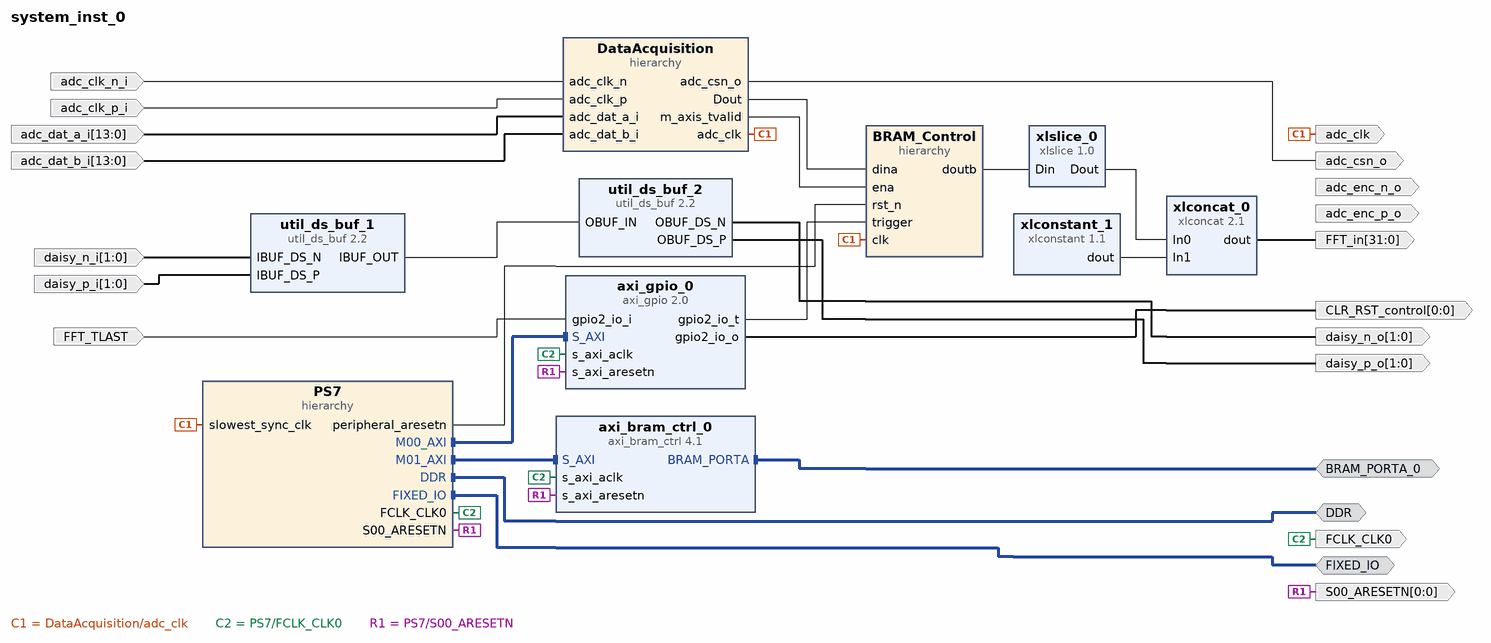
[diagram p0: block diagram of the top level]
# Vivado block design system_inst_0, xc7z010clg400-1, Vivado 2024.2
create_bd_design system_inst_0

create_bd_intf_port -mode Master -vlnv xilinx.com:interface:ddrx_rtl:1.0 DDR
create_bd_intf_port -mode Master -vlnv xilinx.com:display_processing_system7:fixedio_rtl:1.0 FIXED_IO
create_bd_intf_port -mode Master -vlnv xilinx.com:interface:bram_rtl:1.0 BRAM_PORTA_0
create_bd_port -dir I -from 13 -to 0 adc_dat_a_i
create_bd_port -dir I -from 13 -to 0 adc_dat_b_i
create_bd_port -dir O adc_enc_p_o
create_bd_port -dir O adc_enc_n_o
create_bd_port -dir O adc_csn_o
create_bd_port -dir O -from 1 -to 0 daisy_p_o
create_bd_port -dir O -from 1 -to 0 daisy_n_o
create_bd_port -dir I -from 1 -to 0 daisy_p_i
create_bd_port -dir I -from 1 -to 0 daisy_n_i
create_bd_port -dir O -from 31 -to 0 FFT_in
create_bd_port -dir O -from 0 -to 0 CLR_RST_control
create_bd_port -dir I FFT_TLAST
create_bd_port -dir O -type clk FCLK_CLK0
create_bd_port -dir O -from 0 -to 0 -type rst S00_ARESETN
create_bd_port -dir I -type clk adc_clk_p_i
create_bd_port -dir I -type clk adc_clk_n_i
create_bd_port -dir O -type clk adc_clk

create_bd_cell -type ip -vlnv xilinx.com:ip:util_ds_buf:2.2 util_ds_buf_1
set_property -dict {CONFIG.C_SIZE 2} [get_bd_cells util_ds_buf_1]
create_bd_cell -type ip -vlnv xilinx.com:ip:util_ds_buf:2.2 util_ds_buf_2
set_property -dict {CONFIG.C_BUF_TYPE OBUFDS CONFIG.C_SIZE 2} [get_bd_cells util_ds_buf_2]
create_bd_cell -type hier PS7
create_bd_cell -type hier DataAcquisition
create_bd_cell -type ip -vlnv xilinx.com:ip:axi_gpio:2.0 axi_gpio_0
set_property -dict [list \
  CONFIG.C_ALL_INPUTS 1 \
  CONFIG.C_ALL_OUTPUTS_2 0 \
  CONFIG.C_GPIO2_WIDTH 1 \
  CONFIG.C_GPIO_WIDTH 32 \
  CONFIG.C_INTERRUPT_PRESENT 0 \
  CONFIG.C_IS_DUAL 1 \
] [get_bd_cells axi_gpio_0]
create_bd_cell -type hier BRAM_Control
create_bd_cell -type ip -vlnv xilinx.com:ip:xlslice:1.0 xlslice_0
set_property -dict {CONFIG.DIN_FROM 15} [get_bd_cells xlslice_0]
create_bd_cell -type ip -vlnv xilinx.com:ip:xlconstant:1.1 xlconstant_1
set_property -dict {CONFIG.CONST_VAL 0 CONFIG.CONST_WIDTH 16} [get_bd_cells xlconstant_1]
create_bd_cell -type ip -vlnv xilinx.com:ip:xlconcat:2.1 xlconcat_0
set_property -dict {CONFIG.IN0_WIDTH 16 CONFIG.IN1_WIDTH 16} [get_bd_cells xlconcat_0]
create_bd_cell -type ip -vlnv xilinx.com:ip:axi_bram_ctrl:4.1 axi_bram_ctrl_0
set_property -dict {CONFIG.DATA_WIDTH 64 CONFIG.SINGLE_PORT_BRAM 1} [get_bd_cells axi_bram_ctrl_0]

# ---- hierarchy /PS7 ----
current_bd_instance /PS7
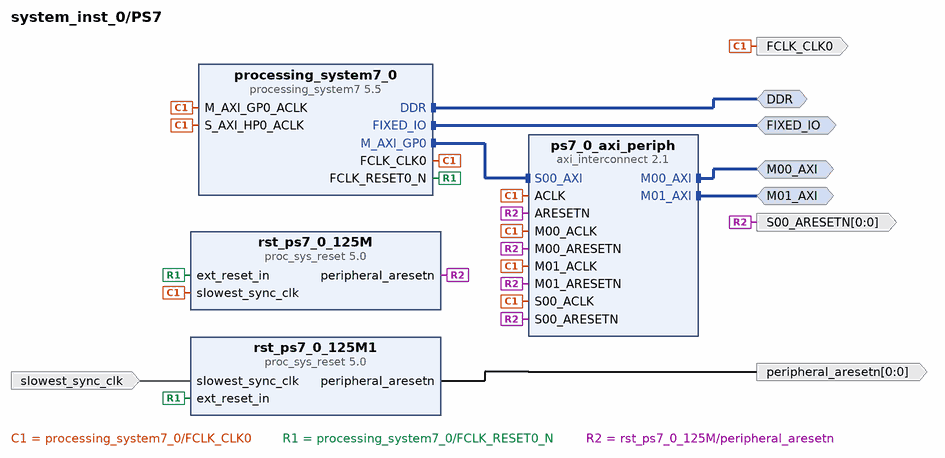
[diagram p1: block diagram inside /PS7]
create_bd_intf_pin -mode Master -vlnv xilinx.com:interface:ddrx_rtl:1.0 DDR
create_bd_intf_pin -mode Master -vlnv xilinx.com:display_processing_system7:fixedio_rtl:1.0 FIXED_IO
create_bd_intf_pin -mode Master -vlnv xilinx.com:interface:aximm_rtl:1.0 M00_AXI
create_bd_intf_pin -mode Master -vlnv xilinx.com:interface:aximm_rtl:1.0 M01_AXI
create_bd_pin -dir O -type clk FCLK_CLK0
create_bd_pin -dir O -from 0 -to 0 -type rst S00_ARESETN
create_bd_pin -dir I -type clk slowest_sync_clk
create_bd_pin -dir O -from 0 -to 0 -type rst peripheral_aresetn

create_bd_cell -type ip -vlnv xilinx.com:ip:processing_system7:5.5 processing_system7_0
set_property -dict [list \
  CONFIG.PCW_APU_PERIPHERAL_FREQMHZ 666.666666 \
  CONFIG.PCW_ENET0_ENET0_IO {MIO 16 .. 27} \
  CONFIG.PCW_ENET0_GRP_MDIO_ENABLE 1 \
  CONFIG.PCW_ENET0_GRP_MDIO_IO EMIO \
  CONFIG.PCW_ENET0_PERIPHERAL_ENABLE 1 \
  CONFIG.PCW_ENET0_RESET_ENABLE 0 \
  CONFIG.PCW_ENET_RESET_ENABLE 1 \
  CONFIG.PCW_ENET_RESET_SELECT {Share reset pin} \
  CONFIG.PCW_FPGA0_PERIPHERAL_FREQMHZ 125 \
  CONFIG.PCW_FPGA1_PERIPHERAL_FREQMHZ 250 \
  CONFIG.PCW_FPGA3_PERIPHERAL_FREQMHZ 200 \
  CONFIG.PCW_GPIO_MIO_GPIO_ENABLE 1 \
  CONFIG.PCW_GPIO_MIO_GPIO_IO MIO \
  CONFIG.PCW_GPIO_PERIPHERAL_ENABLE 1 \
  CONFIG.PCW_I2C0_GRP_INT_ENABLE 0 \
  CONFIG.PCW_I2C0_I2C0_IO {MIO 50 .. 51} \
  CONFIG.PCW_I2C0_PERIPHERAL_ENABLE 1 \
  CONFIG.PCW_I2C_PERIPHERAL_FREQMHZ 111.111115 \
  CONFIG.PCW_I2C_RESET_ENABLE 1 \
  CONFIG.PCW_I2C_RESET_SELECT {Share reset pin} \
  CONFIG.PCW_IMPORT_BOARD_PRESET cfg/red_pitaya.xml \
  CONFIG.PCW_PRESET_BANK1_VOLTAGE {LVCMOS 2.5V} \
  CONFIG.PCW_QSPI_GRP_SINGLE_SS_ENABLE 1 \
  CONFIG.PCW_QSPI_GRP_SINGLE_SS_IO {MIO 1 .. 6} \
  CONFIG.PCW_QSPI_PERIPHERAL_ENABLE 1 \
  CONFIG.PCW_QSPI_PERIPHERAL_FREQMHZ 125 \
  CONFIG.PCW_QSPI_QSPI_IO {MIO 1 .. 6} \
  CONFIG.PCW_SD0_GRP_CD_ENABLE 1 \
  CONFIG.PCW_SD0_GRP_CD_IO {MIO 46} \
  CONFIG.PCW_SD0_GRP_WP_ENABLE 1 \
  CONFIG.PCW_SD0_GRP_WP_IO {MIO 47} \
  CONFIG.PCW_SD0_PERIPHERAL_ENABLE 1 \
  CONFIG.PCW_SD0_SD0_IO {MIO 40 .. 45} \
  CONFIG.PCW_SDIO_PERIPHERAL_FREQMHZ 100 \
  CONFIG.PCW_SINGLE_QSPI_DATA_MODE x4 \
  CONFIG.PCW_SPI0_PERIPHERAL_ENABLE 1 \
  CONFIG.PCW_SPI0_SPI0_IO EMIO \
  CONFIG.PCW_SPI1_PERIPHERAL_ENABLE 1 \
  CONFIG.PCW_SPI1_SPI1_IO {MIO 10 .. 15} \
  CONFIG.PCW_TTC0_PERIPHERAL_ENABLE 1 \
  CONFIG.PCW_TTC0_TTC0_IO EMIO \
  CONFIG.PCW_UART0_PERIPHERAL_ENABLE 1 \
  CONFIG.PCW_UART0_UART0_IO {MIO 14 .. 15} \
  CONFIG.PCW_UART1_PERIPHERAL_ENABLE 1 \
  CONFIG.PCW_UART1_UART1_IO {MIO 8 .. 9} \
  CONFIG.PCW_UART_PERIPHERAL_FREQMHZ 100 \
  CONFIG.PCW_UIPARAM_DDR_BUS_WIDTH {16 Bit} \
  CONFIG.PCW_UIPARAM_DDR_FREQ_MHZ 533.333333 \
  CONFIG.PCW_UIPARAM_DDR_PARTNO {MT41J256M16 RE-125} \
  CONFIG.PCW_USB0_PERIPHERAL_ENABLE 1 \
  CONFIG.PCW_USB0_RESET_ENABLE 1 \
  CONFIG.PCW_USB0_RESET_IO {MIO 48} \
  CONFIG.PCW_USB0_USB0_IO {MIO 28 .. 39} \
  CONFIG.PCW_USB_RESET_ENABLE 1 \
  CONFIG.PCW_USB_RESET_SELECT {Share reset pin} \
  CONFIG.PCW_USE_S_AXI_HP0 1 \
] [get_bd_cells processing_system7_0]
# 425 more settings of processing_system7_0 are not shown: defaults, MIO pin electricals, DDR timing, and values the tool derives
create_bd_cell -type ip -vlnv xilinx.com:ip:proc_sys_reset:5.0 rst_ps7_0_125M
create_bd_cell -type ip -vlnv xilinx.com:ip:axi_interconnect:2.1 ps7_0_axi_periph
set_property -dict {CONFIG.NUM_MI 2} [get_bd_cells ps7_0_axi_periph]
create_bd_cell -type ip -vlnv xilinx.com:ip:proc_sys_reset:5.0 rst_ps7_0_125M1

# ---- hierarchy /DataAcquisition ----
current_bd_instance /DataAcquisition
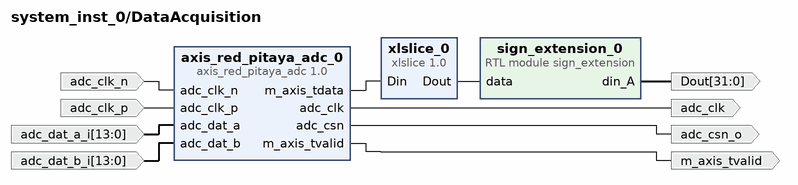
[diagram p2: block diagram inside /DataAcquisition]
create_bd_pin -dir O -type clk adc_clk
create_bd_pin -dir O adc_csn_o
create_bd_pin -dir I -from 13 -to 0 adc_dat_a_i
create_bd_pin -dir I -from 13 -to 0 adc_dat_b_i
create_bd_pin -dir O -from 31 -to 0 Dout
create_bd_pin -dir O m_axis_tvalid
create_bd_pin -dir I -type clk adc_clk_p
create_bd_pin -dir I -type clk adc_clk_n

create_bd_cell -type ip -vlnv pavel-demin:user:axis_red_pitaya_adc:1.0 axis_red_pitaya_adc_0
create_bd_cell -type ip -vlnv xilinx.com:ip:xlslice:1.0 xlslice_0
set_property -dict {CONFIG.DIN_FROM 15} [get_bd_cells xlslice_0]
create_bd_cell -type module -reference sign_extension sign_extension_0

# ---- hierarchy /BRAM_Control ----
current_bd_instance /BRAM_Control
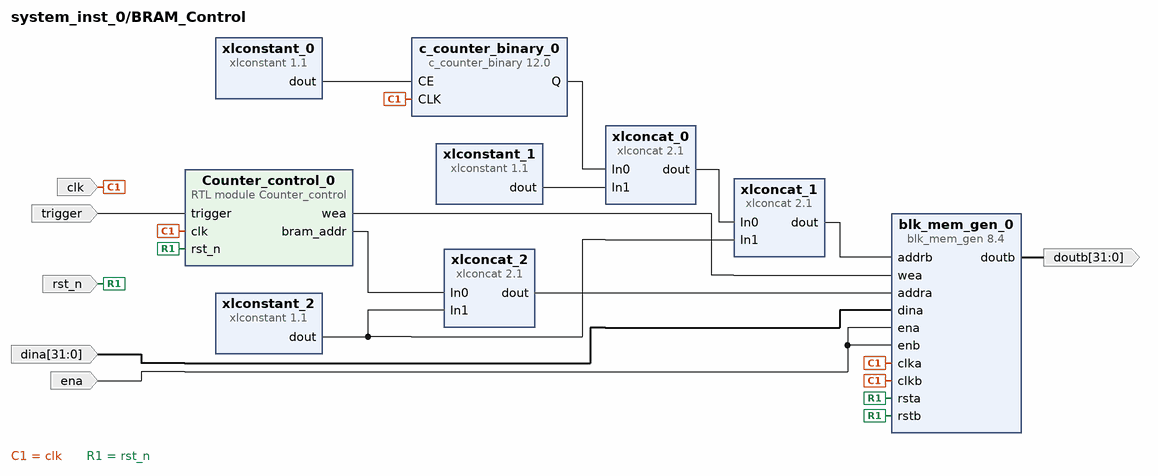
[diagram p3: block diagram inside /BRAM_Control]
create_bd_pin -dir I -type clk clk
create_bd_pin -dir I -type rst rst_n
create_bd_pin -dir I -from 31 -to 0 dina
create_bd_pin -dir I ena
create_bd_pin -dir I trigger
create_bd_pin -dir O -from 31 -to 0 doutb

create_bd_cell -type ip -vlnv xilinx.com:ip:blk_mem_gen:8.4 blk_mem_gen_0
set_property -dict {CONFIG.Memory_Type True_Dual_Port_RAM CONFIG.use_bram_block BRAM_Controller} [get_bd_cells blk_mem_gen_0]
create_bd_cell -type module -reference Counter_control Counter_control_0
create_bd_cell -type ip -vlnv xilinx.com:ip:c_counter_binary:12.0 c_counter_binary_0
set_property -dict [list \
  CONFIG.AINIT_Value 3FF \
  CONFIG.CE true \
  CONFIG.Implementation Fabric \
  CONFIG.Increment_Value 1 \
  CONFIG.Load false \
  CONFIG.Output_Width 10 \
  CONFIG.Restrict_Count false \
  CONFIG.SCLR false \
  CONFIG.SINIT false \
  CONFIG.SSET false \
] [get_bd_cells c_counter_binary_0]
create_bd_cell -type ip -vlnv xilinx.com:ip:xlconstant:1.1 xlconstant_0
create_bd_cell -type ip -vlnv xilinx.com:ip:xlconcat:2.1 xlconcat_0
set_property -dict {CONFIG.IN0_WIDTH 10 CONFIG.IN1_WIDTH 2} [get_bd_cells xlconcat_0]
create_bd_cell -type ip -vlnv xilinx.com:ip:xlconstant:1.1 xlconstant_1
set_property -dict {CONFIG.CONST_VAL 0 CONFIG.CONST_WIDTH 2} [get_bd_cells xlconstant_1]
create_bd_cell -type ip -vlnv xilinx.com:ip:xlconstant:1.1 xlconstant_2
set_property -dict {CONFIG.CONST_VAL 0 CONFIG.CONST_WIDTH 20} [get_bd_cells xlconstant_2]
create_bd_cell -type ip -vlnv xilinx.com:ip:xlconcat:2.1 xlconcat_1
set_property -dict {CONFIG.IN0_WIDTH 12 CONFIG.IN1_WIDTH 20} [get_bd_cells xlconcat_1]
create_bd_cell -type ip -vlnv xilinx.com:ip:xlconcat:2.1 xlconcat_2
set_property -dict {CONFIG.IN0_WIDTH 12 CONFIG.IN1_WIDTH 20} [get_bd_cells xlconcat_2]

# ---- connections ----

current_bd_instance /PS7
connect_bd_intf_net [get_bd_intf_pins DDR] [get_bd_intf_pins processing_system7_0/DDR]
connect_bd_intf_net [get_bd_intf_pins FIXED_IO] [get_bd_intf_pins processing_system7_0/FIXED_IO]
connect_bd_intf_net [get_bd_intf_pins processing_system7_0/M_AXI_GP0] [get_bd_intf_pins ps7_0_axi_periph/S00_AXI]
connect_bd_intf_net [get_bd_intf_pins M00_AXI] [get_bd_intf_pins ps7_0_axi_periph/M00_AXI]
connect_bd_intf_net [get_bd_intf_pins M01_AXI] [get_bd_intf_pins ps7_0_axi_periph/M01_AXI]
connect_bd_net [get_bd_pins processing_system7_0/FCLK_CLK0] \
  [get_bd_pins FCLK_CLK0] [get_bd_pins processing_system7_0/S_AXI_HP0_ACLK] [get_bd_pins ps7_0_axi_periph/S00_ACLK] \
  [get_bd_pins rst_ps7_0_125M/slowest_sync_clk] [get_bd_pins ps7_0_axi_periph/M00_ACLK] [get_bd_pins ps7_0_axi_periph/ACLK] \
  [get_bd_pins ps7_0_axi_periph/M01_ACLK] [get_bd_pins processing_system7_0/M_AXI_GP0_ACLK]
connect_bd_net [get_bd_pins processing_system7_0/FCLK_RESET0_N] [get_bd_pins rst_ps7_0_125M/ext_reset_in] [get_bd_pins rst_ps7_0_125M1/ext_reset_in]
connect_bd_net [get_bd_pins rst_ps7_0_125M1/peripheral_aresetn] [get_bd_pins peripheral_aresetn]
connect_bd_net [get_bd_pins rst_ps7_0_125M/peripheral_aresetn] \
  [get_bd_pins S00_ARESETN] [get_bd_pins ps7_0_axi_periph/S00_ARESETN] [get_bd_pins ps7_0_axi_periph/M00_ARESETN] \
  [get_bd_pins ps7_0_axi_periph/ARESETN] [get_bd_pins ps7_0_axi_periph/M01_ARESETN]
connect_bd_net [get_bd_pins slowest_sync_clk] [get_bd_pins rst_ps7_0_125M1/slowest_sync_clk]
set_property HDL_ATTRIBUTE.BMM_INFO_PROCESSOR {arm > system BRAM_Control/axi_bram_ctrl_0} [get_bd_cells processing_system7_0]
set_property HDL_ATTRIBUTE.KEEP_HIERARCHY yes [get_bd_cells processing_system7_0]

current_bd_instance /DataAcquisition
connect_bd_net -net adc_clk_n_0_1 [get_bd_pins adc_clk_n] [get_bd_pins axis_red_pitaya_adc_0/adc_clk_n]
connect_bd_net -net adc_clk_p_0_1 [get_bd_pins adc_clk_p] [get_bd_pins axis_red_pitaya_adc_0/adc_clk_p]
connect_bd_net [get_bd_pins adc_dat_a_i] [get_bd_pins axis_red_pitaya_adc_0/adc_dat_a]
connect_bd_net [get_bd_pins adc_dat_b_i] [get_bd_pins axis_red_pitaya_adc_0/adc_dat_b]
connect_bd_net [get_bd_pins axis_red_pitaya_adc_0/adc_clk] [get_bd_pins adc_clk]
connect_bd_net [get_bd_pins axis_red_pitaya_adc_0/adc_csn] [get_bd_pins adc_csn_o]
connect_bd_net [get_bd_pins axis_red_pitaya_adc_0/m_axis_tdata] [get_bd_pins xlslice_0/Din]
connect_bd_net [get_bd_pins axis_red_pitaya_adc_0/m_axis_tvalid] [get_bd_pins m_axis_tvalid]
connect_bd_net [get_bd_pins sign_extension_0/din_A] [get_bd_pins Dout]
connect_bd_net [get_bd_pins xlslice_0/Dout] [get_bd_pins sign_extension_0/data]

current_bd_instance /BRAM_Control
connect_bd_net [get_bd_pins Counter_control_0/bram_addr] [get_bd_pins xlconcat_2/In0]
connect_bd_net [get_bd_pins Counter_control_0/wea] [get_bd_pins blk_mem_gen_0/wea]
connect_bd_net -net DataAcquisition_adc_clk [get_bd_pins clk] \
  [get_bd_pins blk_mem_gen_0/clka] [get_bd_pins Counter_control_0/clk] [get_bd_pins blk_mem_gen_0/clkb] \
  [get_bd_pins c_counter_binary_0/CLK]
connect_bd_net [get_bd_pins blk_mem_gen_0/doutb] [get_bd_pins doutb]
connect_bd_net [get_bd_pins c_counter_binary_0/Q] [get_bd_pins xlconcat_0/In0]
connect_bd_net [get_bd_pins dina] [get_bd_pins blk_mem_gen_0/dina]
connect_bd_net [get_bd_pins ena] [get_bd_pins blk_mem_gen_0/ena] [get_bd_pins blk_mem_gen_0/enb]
connect_bd_net [get_bd_pins rst_n] [get_bd_pins Counter_control_0/rst_n] [get_bd_pins blk_mem_gen_0/rsta] [get_bd_pins blk_mem_gen_0/rstb]
connect_bd_net [get_bd_pins trigger] [get_bd_pins Counter_control_0/trigger]
connect_bd_net [get_bd_pins xlconcat_0/dout] [get_bd_pins xlconcat_1/In0]
connect_bd_net [get_bd_pins xlconcat_1/dout] [get_bd_pins blk_mem_gen_0/addrb]
connect_bd_net [get_bd_pins xlconcat_2/dout] [get_bd_pins blk_mem_gen_0/addra]
connect_bd_net [get_bd_pins xlconstant_0/dout] [get_bd_pins c_counter_binary_0/CE]
connect_bd_net [get_bd_pins xlconstant_1/dout] [get_bd_pins xlconcat_0/In1]
connect_bd_net [get_bd_pins xlconstant_2/dout] [get_bd_pins xlconcat_1/In1] [get_bd_pins xlconcat_2/In1]

current_bd_instance /
connect_bd_intf_net [get_bd_intf_pins PS7/M01_AXI] [get_bd_intf_pins axi_bram_ctrl_0/S_AXI]
connect_bd_intf_net [get_bd_intf_ports BRAM_PORTA_0] [get_bd_intf_pins axi_bram_ctrl_0/BRAM_PORTA]
connect_bd_intf_net -intf_net processing_system7_0_DDR [get_bd_intf_ports DDR] [get_bd_intf_pins PS7/DDR]
connect_bd_intf_net -intf_net processing_system7_0_FIXED_IO [get_bd_intf_ports FIXED_IO] [get_bd_intf_pins PS7/FIXED_IO]
connect_bd_intf_net [get_bd_intf_pins PS7/M00_AXI] [get_bd_intf_pins axi_gpio_0/S_AXI]
connect_bd_net [get_bd_pins BRAM_Control/doutb] [get_bd_pins xlslice_0/Din]
connect_bd_net [get_bd_pins DataAcquisition/adc_clk] [get_bd_pins PS7/slowest_sync_clk] [get_bd_pins BRAM_Control/clk] [get_bd_ports adc_clk]
connect_bd_net [get_bd_ports FFT_TLAST] [get_bd_pins axi_gpio_0/gpio2_io_i]
connect_bd_net -net adc_clk_n_0_1 [get_bd_ports adc_clk_n_i] [get_bd_pins DataAcquisition/adc_clk_n]
connect_bd_net -net adc_clk_p_0_1 [get_bd_ports adc_clk_p_i] [get_bd_pins DataAcquisition/adc_clk_p]
connect_bd_net [get_bd_ports adc_dat_a_i] [get_bd_pins DataAcquisition/adc_dat_a_i]
connect_bd_net [get_bd_ports adc_dat_b_i] [get_bd_pins DataAcquisition/adc_dat_b_i]
connect_bd_net [get_bd_pins axi_gpio_0/gpio2_io_o] [get_bd_ports CLR_RST_control]
connect_bd_net [get_bd_pins axi_gpio_0/gpio2_io_t] [get_bd_pins BRAM_Control/trigger]
connect_bd_net -net axis_red_pitaya_adc_0_adc_csn [get_bd_pins DataAcquisition/adc_csn_o] [get_bd_ports adc_csn_o]
connect_bd_net [get_bd_ports daisy_n_i] [get_bd_pins util_ds_buf_1/IBUF_DS_N]
connect_bd_net [get_bd_ports daisy_p_i] [get_bd_pins util_ds_buf_1/IBUF_DS_P]
connect_bd_net -net dina_1 [get_bd_pins DataAcquisition/Dout] [get_bd_pins BRAM_Control/dina]
connect_bd_net -net ena_1 [get_bd_pins DataAcquisition/m_axis_tvalid] [get_bd_pins BRAM_Control/ena]
connect_bd_net -net processing_system7_0_FCLK_CLK0 [get_bd_pins PS7/FCLK_CLK0] \
  [get_bd_pins axi_gpio_0/s_axi_aclk] [get_bd_ports FCLK_CLK0] [get_bd_pins axi_bram_ctrl_0/s_axi_aclk]
connect_bd_net -net rst_n_1 [get_bd_pins PS7/peripheral_aresetn] [get_bd_pins BRAM_Control/rst_n]
connect_bd_net -net rst_ps7_0_125M_peripheral_aresetn [get_bd_pins PS7/S00_ARESETN] \
  [get_bd_pins axi_gpio_0/s_axi_aresetn] [get_bd_ports S00_ARESETN] [get_bd_pins axi_bram_ctrl_0/s_axi_aresetn]
connect_bd_net [get_bd_pins util_ds_buf_1/IBUF_OUT] [get_bd_pins util_ds_buf_2/OBUF_IN]
connect_bd_net [get_bd_pins util_ds_buf_2/OBUF_DS_N] [get_bd_ports daisy_n_o]
connect_bd_net [get_bd_pins util_ds_buf_2/OBUF_DS_P] [get_bd_ports daisy_p_o]
connect_bd_net [get_bd_pins xlconcat_0/dout] [get_bd_ports FFT_in]
connect_bd_net [get_bd_pins xlconstant_1/dout] [get_bd_pins xlconcat_0/In1]
connect_bd_net [get_bd_pins xlslice_0/Dout] [get_bd_pins xlconcat_0/In0]

# ---- address map ----
assign_bd_address -offset 0x40000000 -range 8K -target_address_space [get_bd_addr_spaces PS7/processing_system7_0/Data] [get_bd_addr_segs axi_bram_ctrl_0/S_AXI/Mem0]
assign_bd_address -offset 0x42000000 -range 4K -target_address_space [get_bd_addr_spaces PS7/processing_system7_0/Data] [get_bd_addr_segs axi_gpio_0/S_AXI/Reg]

validate_bd_design
save_bd_design
